# Altium schematic sheet Driver.SchDoc
size A; SheetNumber: 3; SheetTotal: 9
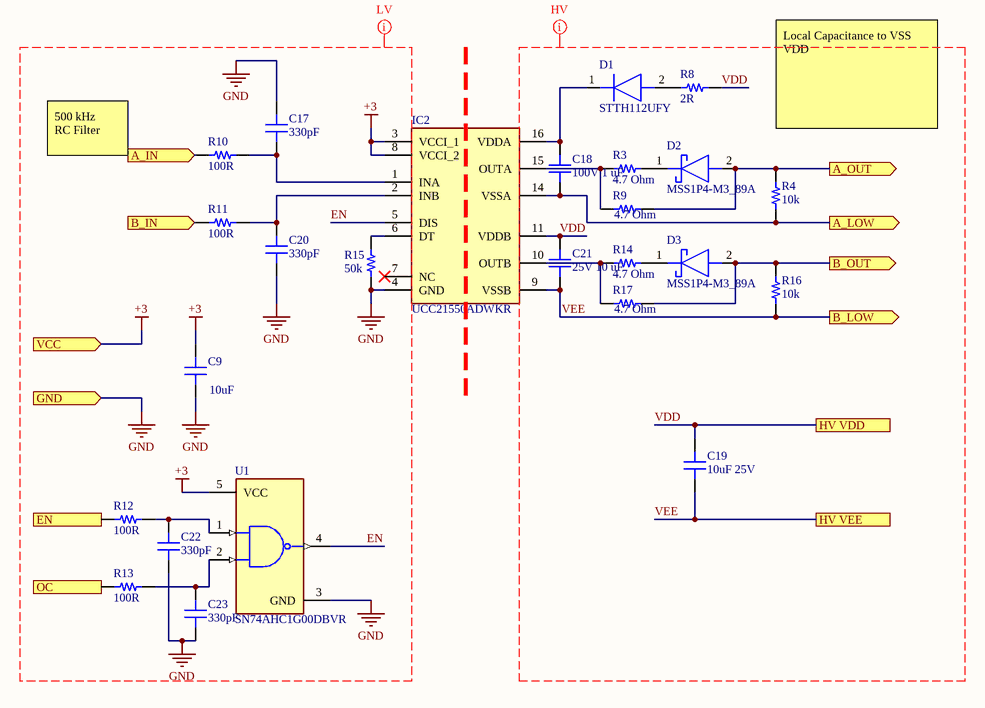
[diagram p0: Driver.SchDoc]

## Parts
C9  10uF  [CAP 0805_2012]
C17  330pF  [CAP 0402_1005]
C18  100V 1 uF  [CAP 1206_3216 - 0.8MM]
C19  10uF 25V  [CAP 1210_3225 - 1MM]
C20  330pF  [CAP 0402_1005]
C21  25V 10 uF  [CAP 1206_3216 - 0.8MM]
C22  330pF  [CAP 0402_1005]
C23  330pF  [CAP 0402_1005]
D1  STTH112UFY  [DIOM5436X110N]
D2  MSS1P4-M3_89A  [MICROSMP]
D3  MSS1P4-M3_89A  [MICROSMP]
IC2  UCC21550ADWKR  [UCC21550ADWKR]
R3  4.7 Ohm  [YAGEO RES 1206_3216]
R4  10k  [RES 0402_1005]
R8  2R  [YAGEO RES 1206_3216]
R9  4.7 Ohm  [YAGEO RES 1206_3216]
R10  100R  [RES 0402_1005]
R11  100R  [RES 0402_1005]
R12  100R  [RES 0402_1005]
R13  100R  [RES 0402_1005]
R14  4.7 Ohm  [YAGEO RES 1206_3216]
R15  50k  [RES 0402_1005]
R16  10k  [RES 0402_1005]
R17  4.7 Ohm  [YAGEO RES 1206_3216]
U1  SN74AHC1G00DBVR  [FP-DBV0005A-MFG]

## Ports
A_IN (in), A_LOW (out), A_OUT (out), B_IN (in), B_LOW (out), B_OUT (out), EN (in), GND (in), HV VDD, HV VEE, OC (in), VCC (in)

## Nets
+3: C9.2 IC2.3(VCCI_1) IC2.8(VCCI_2) U1.5(VCC) ; port VCC
GND: C9.1 C17.2 C20.1 C22.1 C23.1 IC2.4(GND) R15.2 U1.3(GND) ; port GND
A_IN: R10.1 ; port A_IN
A_LOW: C18.1 IC2.14(VSSA) R4.2 ; port A_LOW
A_OUT: D2.2(A) R4.1 R9.2 ; port A_OUT
B_IN: R11.1 ; port B_IN
B_OUT: D3.2(A) R16.1 R17.2 ; port B_OUT
EN: IC2.5(DIS) U1.4(Y)
EN: R12.1 ; port EN  [a separate net that carries the same name]
OC: R13.1 ; port OC
VDD: C19.1 C21.2 IC2.11(VDDB) R8.1 ; port HV VDD
VEE: C19.2 C21.1 IC2.9(VSSB) R16.2 ; port B_LOW, port HV VEE
NetC17_1: C17.1 IC2.1(INA) R10.2
NetC18_2: C18.2 D1.1(K) IC2.16(VDDA)
NetC20_2: C20.2 IC2.2(INB) R11.2
NetC22_2: C22.2 R12.2 U1.1(A)
NetC23_2: C23.2 R13.2 U1.2(B)
NetD1_2: D1.2(A) R8.2
NetD2_1: D2.1(K) R3.2
NetD3_1: D3.1(K) R14.2
NetIC2_6: IC2.6(DT) R15.1
NetIC2_10: IC2.10(OUTB) R14.1 R17.1
NetIC2_15: IC2.15(OUTA) R3.1 R9.1

Not connected (* = marked no-connect by the designer): IC2 7(NC)*

## Layout directives
net class HV: VDD, VEE
net class LV: +3, EN, GND

## Notes on the sheet
- 500 kHz
  RC Filter
- Local Capacitance to VSS VDD

## Library data of the parts
C9 = CGA4J3X7R1C155M125AB: CAP CER 1.5UF 16V X7R 0805; manufacturer: TDK Corporation; Capacitance: 1.5 µF; Tolerance: ±20%; value: 1.5 µF; Part Number: CGA4J3X7R1C155M125AB; Applications: Automotive; componentlink1description: Datasheet; componentlink1url: https://product.tdk.com/info/en/catalog/datasheets/mlcc_automotive_general_en.pdf?ref_disty=digikey; componentlink2description: DigiKey Link; componentlink2url: https://www.digikey.com/en/products/detail/tdk-corporation/CGA4J3X7R1C155M125AB/3949968; Device Package: 0805 (2012 Metric); lastupdated: 2/9/2024 8:15:20 PM; Lifecycle Status: Active; Minimum Order: 1; Mounting Type: Surface Mount, MLCC; Operating Temperature: -55°C ~ 125°C; Package / Case: 0805 (2012 Metric); packaging: TapeAndReel; partid: 18072; Part Status: Active; price: 0.04; Ratings: AEC-Q200; series: CGA; Size / Dimension: 0.079" L x 0.049" W (2.00mm x 1.25mm); Supplier 1: DigiKey; Supplier Part Number 1: 445-12732-1-ND; Temperature Coefficient: X7R; Thickness (Max): 0.057" (1.45mm); Voltage - Rated: 16V
C17 C20 C22 C23 = ZRB157R61E225KE11D: CAP CER 2F 25V X5R 0402; manufacturer: Murata Electronics; Capacitance: 2.2 µF; Tolerance: ±10%; value: 2.2 µF; Part Number: ZRB157R61E225KE11D; Applications: Acoustic Noise Reduction; componentlink1description: Datasheet; componentlink1url: https://search.murata.co.jp/Ceramy/image/img/A01X/G101/ENG/ZRB157R61E225KE11-01.pdf; componentlink2description: DigiKey Link; componentlink2url: https://www.digikey.com/en/products/detail/murata-electronics/ZRB157R61E225KE11D/5321074; Device Package: 0402 (1005 Metric); Features: Interposer Termination; lastupdated: 2/9/2024 8:04:27 PM; Lifecycle Status: Active; Minimum Order: 1; Mounting Type: Surface Mount, MLCC; Operating Temperature: -55°C ~ 85°C; Package / Case: 0402 (1005 Metric); packaging: TapeAndReel; partid: 8590; Part Status: Active; price: 0.04; series: ZRB; Size / Dimension: 0.039" L x 0.020" W (1.00mm x 0.50mm); Supplier 1: DigiKey; Supplier Part Number 1: 490-10982-1-ND; Temperature Coefficient: X5R; Thickness (Max): 0.033" (0.85mm); Voltage - Rated: 25V
C18 C21 = VPDD631W103K1GV001E: HV CAP 0.01F 630V 1206 X7R; manufacturer: Johanson Dielectrics Inc.; Capacitance: 10000 pF; Tolerance: ±10%; value: 10000 pF; Part Number: VPDD631W103K1GV001E; Applications: General Purpose; componentlink1description: Datasheet; componentlink1url: https://www.johansondielectrics.com/datasheets/export/e1.php?name=VPDD631W103K1GV001E; componentlink2description: DigiKey Link; componentlink2url: https://www.digikey.com/en/products/detail/johanson-dielectrics-inc/VPDD631W103K1GV001E/21283575; Device Package: 1206 (3216 Metric); Features: High Voltage; lastupdated: 6/4/2024 7:09:59 PM; Lifecycle Status: Active; Minimum Order: 1; Mounting Type: Surface Mount, MLCC; Operating Temperature: -55°C ~ 125°C; Package / Case: 1206 (3216 Metric); packaging: TapeAndReel; partid: 57082; price: 0.02; series: HVS-PME; Size / Dimension: 0.125" L x 0.062" W (3.17mm x 1.57mm); Supplier 1: DigiKey; Supplier Part Number 1: 709-VPDD631W103K1GV001ECT-ND; Temperature Coefficient: X7R; Thickness (Max): 0.067" (1.70mm); Voltage - Rated: 630V
C19 = MSAST32NSB5106MTNA01: CAP CER 10UF 25V X5R 1210; manufacturer: Taiyo Yuden; Value: 10 µF; Tolerance: ±20%; Part Number: MSAST32NSB5106MTNA01; Applications: SMPS Filtering; Capacitance: 10 µF; componentlink1description: Datasheet; componentlink1url: https://mm.digikey.com/Volume0/opasdata/d220001/medias/docus/5731/MSR01_e.pdf; componentlink2description: DigiKey Link; componentlink2url: https://www.digikey.com/en/products/detail/taiyo-yuden/MSAST32NSB5106MTNA01/16661899; Device Package: 1210 (3225 Metric); lastupdated: 6/4/2024 7:20:40 PM; Lifecycle Status: Active; Minimum Order: 1; Mounting Type: Surface Mount, MLCC; Operating Temperature: -55°C ~ 85°C; Package / Case: 1210 (3225 Metric); packaging: TapeAndReel; partid: 58126; price: 0.08; series: MSAS; Size / Dimension: 0.126" L x 0.098" W (3.20mm x 2.50mm); Supplier 1: DigiKey; Supplier Part Number 1: 587-MSAST32NSB5106MTNA01CT-ND; Temperature Coefficient: X5R; Thickness (Max): 0.083" (2.10mm); Voltage - Rated: 25V
D1 = STTH112UFY: Diode; Manufacturer_Name: STMicroelectronics; Datasheet Link: https://www.st.com/resource/en/datasheet/stth112-y.pdf; Height: 1.1mm; Manufacturer_Part_Number: STTH112UFY; Mouser Part Number: 511-STTH112UFY; Mouser Price/Stock: https://www.mouser.co.uk/ProductDetail/STMicroelectronics/STTH112UFY?qs=DqCdCwOw4%2F7HJr4wLNNIMw%3D%3D; Arrow Part Number: STTH112UFY; Arrow Price/Stock: https://www.arrow.com/en/products/stth112ufy/stmicroelectronics?region=europe
D2 D3 = MSS1P4-M3_89A: Schottky Diode; Manufacturer_Name: Vishay; Manufacturer_Part_Number: MSS1P4-M3/89A; Datasheet Link: https://www.vishay.com/docs/89019/mss1p4.pdf; Mouser Part Number: 625-MSS1P4-M3; Mouser Price/Stock: https://www.mouser.co.uk/ProductDetail/Vishay-General-Semiconductor/MSS1P4-M3-89A?qs=fLSHF8TigmUkO6GnwlXAxQ%3D%3D; Arrow Part Number: MSS1P4-M3/89A; Arrow Price/Stock: https://www.arrow.com/en/products/mss1p4-m389a/vishay?utm_currency=USD&region=nac
IC2 = UCC21550ADWKR: Integrated Circuit; Manufacturer_Name: Texas Instruments; Datasheet Link: https://www.ti.com/lit/gpn/UCC21550; Height: 2.65mm; Manufacturer_Part_Number: UCC21550ADWKR; Mouser Part Number: 595-UCC21550ADWKR; Mouser Price/Stock: https://www.mouser.co.uk/ProductDetail/Texas-Instruments/UCC21550ADWKR?qs=IKkN%2F947nfBAXILs21qR6A%3D%3D; Arrow Part Number: UCC21550ADWKR; Arrow Price/Stock: https://www.arrow.com/en/products/ucc21550adwkr/texas-instruments?utm_currency=USD&region=nac
R3 R8 R9 R14 R17 = RL1206FR-7W0R1L: RES 0.1 OHM 1% 1/2W 1206; Manufacturer: Yageo; Power (Watts): 0.5W, 1/2W; Resistance: 100 mOhms; Temperature Coefficient: ±600ppm/°C; Value: 100 mOhms; Part Number: RL1206FR-7W0R1L; ComponentLink1Description: Datasheet; ComponentLink1URL: http://www.yageo.com/documents/recent/PYu-RL_Group_521_RoHS_L_2.pdf; ComponentLink2Description: DigiKey Link; ComponentLink2URL: https://www.digikey.com/en/products/detail/yageo/RL1206FR-7W0R1L/2827682; Composition: Thick Film; Device Package: 1206 (3216 Metric); Features: Current Sense; Height - Seated (Max): 0.026" (0.65mm); LastUpdated: 7/25/2024 9:21:39 AM; Lifecycle Status: Active; Minimum Order: 1; Number of Terminations: 2; Operating Temperature: -55°C ~ 125°C; Package / Case: 1206 (3216 Metric); Packaging: TapeAndReel; PartId: 26837; Part Status: Active; Price: 0.08; Ratings: AEC-Q200; Series: RL; Size / Dimension: 0.122" L x 0.063" W (3.10mm x 1.60mm); Supplier 1: DigiKey; Supplier Part Number 1: 311-0.1LYCT-ND; Supplier Device Package: 1206; Tolerance: ±1%
R4 R10-R13 R15 R16 = RP73PF1E249KBTD: RES 249K OHM 0.1% 1/10W 0402; Manufacturer: TE Connectivity Passive Product; Value: 249 kOhms; Power (Watts): 0.1W, 1/10W; Temperature Coefficient: ±25ppm/°C; Part Number: RP73PF1E249KBTD; ComponentLink1Description: Datasheet; ComponentLink1URL: https://www.te.com/commerce/DocumentDelivery/DDEController?Action=srchrtrv&DocNm=1773272&DocType=DS&DocLang=English; ComponentLink2Description: DigiKey Link; ComponentLink2URL: https://www.digikey.com/en/products/detail/te-connectivity-passive-product/RP73PF1E249KBTD/8261091; Composition: Thin Film; Device Package: 0402 (1005 Metric); Height - Seated (Max): 0.014" (0.35mm); LastUpdated: 2/9/2024 8:30:24 PM; Lifecycle Status: Active; Minimum Order: 1; Number of Terminations: 2; Operating Temperature: -55°C ~ 155°C; Package / Case: 0402 (1005 Metric); Packaging: TapeAndReel; PartId: 2418; Part Status: Active; Price: 0.07; Resistance: 249 kOhms; Series: RP73, Holsworthy; Size / Dimension: 0.039" L x 0.020" W (1.00mm x 0.50mm); Supplier 1: DigiKey; Supplier Part Number 1: A127549CT-ND; Supplier Device Package: 0402; Tolerance: ±0.1%
U1 = CMP-0859-00172-4: IC GATE NAND 1CH 2-INP SOT23-5; Manufacturer: Texas Instruments; Standoff Height: 0mm; Number Of Outputs: 1; Nominal Supply Current: 1uA; Max Junction Temp: +150°C; Propagation Delay: 5.2ns; Min Supply Voltage: 2V; Max Supply Voltage: 5.5V; Number Of Inputs: 2; Category: IC; Logic Function Desc: NAND; Ambient Temperature Range High: +125°C; Automotive: No; Octopart: https://octopart.com/sn74ahc1g00dbvr-texas+instruments-464400; Device Class L1: Integrated Circuits (ICs); Device Class L2: Logic ICs; RoHS: TRUE; Height: 1.45mm; Digikey Description: IC GATE NAND 1CH 2-INP SOT23-5; Lead Free: Yes; Ambient Temperature Range Low: -40°C; Number Of Circuits: 1; Device Class L3: Logic Gates; Package: DBV0005A; Manufacturer Part Number: SN74AHC1G00DBVR; ComponentLink2URL: https://www.ti.com/lit/ds/symlink/sn74ahc1g00.pdf; Temperature Range Low: -40°C; Temperature: -40°C to +125°C; Temperature Range High: +125°C; ComponentLink2Description: Datasheet